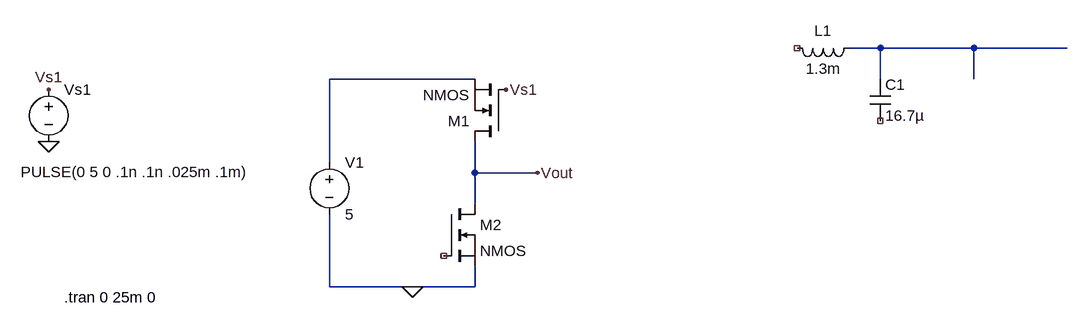
[diagram p0: schematic Draft3.asc]
Draft3.asc, the LTspice schematic file:
Version 4
SHEET 1 1044 680
WIRE 752 -32 704 -32
WIRE 896 -32 752 -32
WIRE 1040 -32 896 -32
WIRE 128 16 -96 16
WIRE 752 16 752 -32
WIRE 896 16 896 -32
WIRE -96 144 -96 16
WIRE 128 160 128 112
WIRE 224 160 128 160
WIRE 128 208 128 160
WIRE -96 336 -96 224
WIRE 32 336 -96 336
WIRE 128 336 128 304
WIRE 128 336 32 336
FLAG 224 160 Vout
FLAG 32 336 0
FLAG -528 112 0
FLAG -528 32 Vs1
FLAG 176 32 Vs1
SYMBOL voltage -96 128 R0
WINDOW 123 0 0 Left 0
WINDOW 39 0 0 Left 0
SYMATTR InstName V1
SYMATTR Value 5
SYMBOL nmos 176 112 R180
SYMATTR InstName M1
SYMBOL nmos 80 208 R0
SYMATTR InstName M2
SYMBOL voltage -528 16 R0
WINDOW 3 -43 143 Left 2
WINDOW 123 0 0 Left 0
WINDOW 39 0 0 Left 0
SYMATTR Value PULSE(0 5 0 .1n .1n .025m .1m)
SYMATTR InstName Vs1
SYMBOL ind 720 -48 R90
WINDOW 0 5 56 VBottom 2
WINDOW 3 32 56 VTop 2
SYMATTR InstName L1
SYMATTR Value 1.3m
SYMBOL cap 736 16 R0
SYMATTR InstName C1
SYMATTR Value 16.7µ
TEXT -504 352 Left 2 !.tran 0 25m 0

The netlist it stands for:
* Draft3.asc
V1 N002 0 5
M1 Vout Vs1 N002 N002 NMOS
M2 Vout NC_01 0 0 NMOS
Vs1 Vs1 0 PULSE(0 5 0 .1n .1n .025m .1m)
L1 N001 NC_02 1.3m
C1 N001 NC_03 16.7µ
.model NMOS NMOS
.model PMOS PMOS
.lib standard.mos
.tran 0 25m 0
.backanno
.end